# Altium schematic sheet AMS_Slave_Balancing.SchDoc: Sheetname
size A4; Date: 05.10.2017; CheckedBy: UNCHECKED; Author: Team Member; Organization: Baltic Racing; Address1: Zur Schwedenschanze 15; Address2: Haus 18; Address3: 18435 Stralsund; Revision: xx.xx; SheetNumber: 3; SheetTotal: 3; Rules: TODO; ProjectName: Projekt
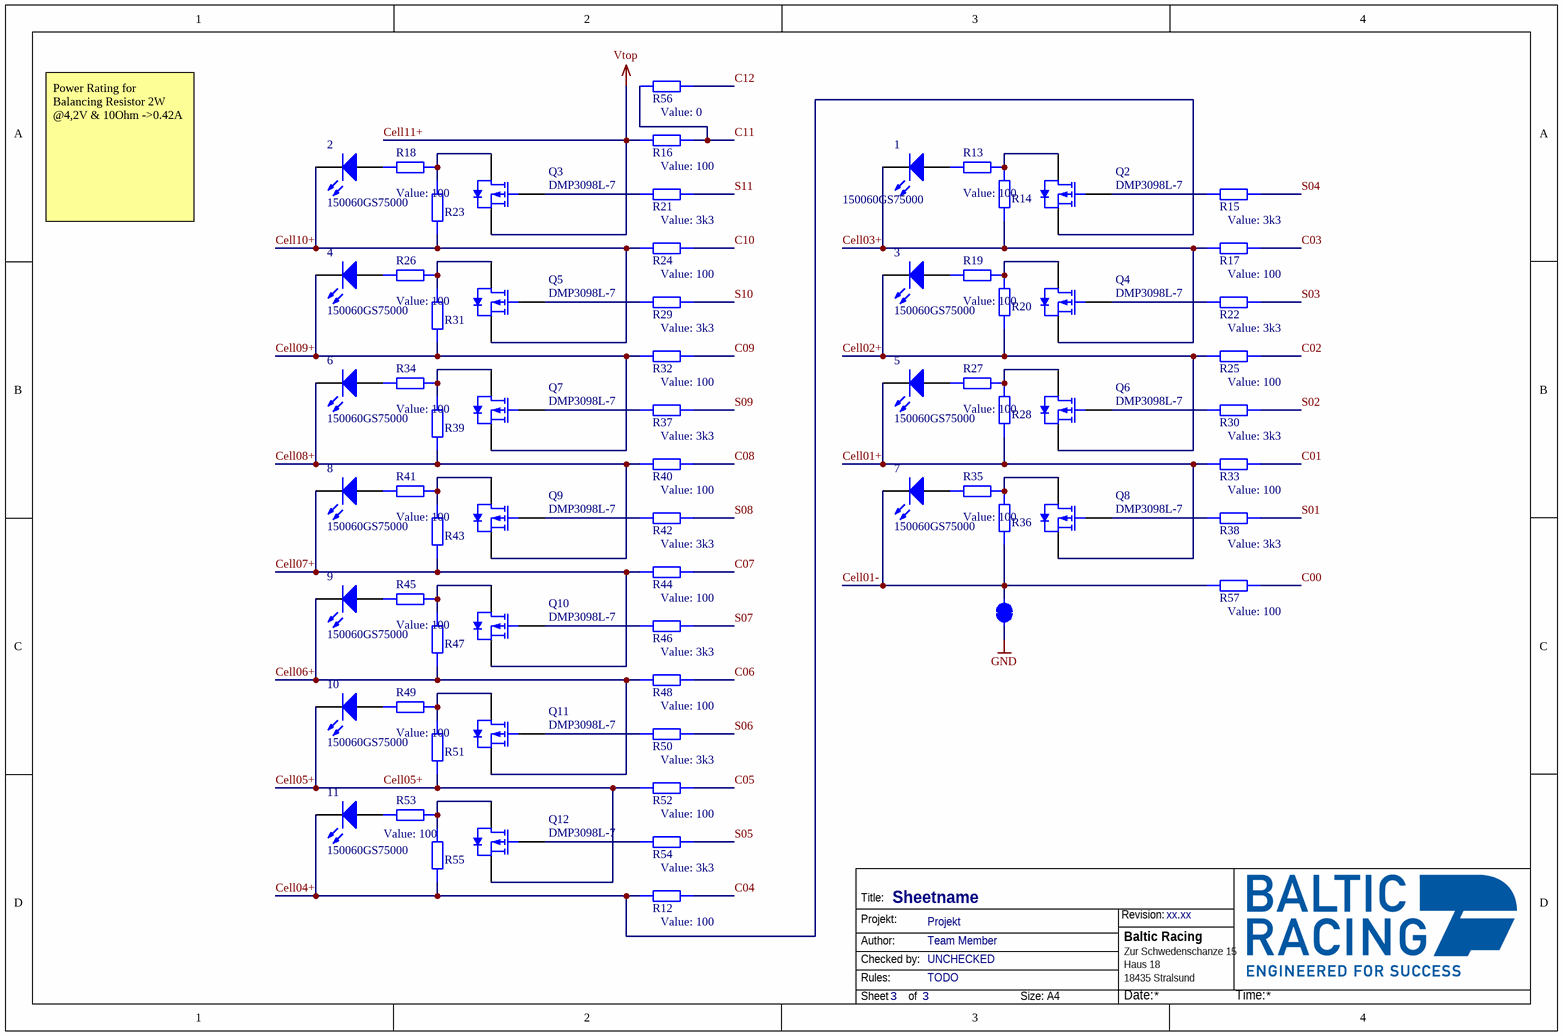
[diagram p0: AMS_Slave_Balancing.SchDoc]

## Parts
1  150060GS75000  [0603_A]
2  150060GS75000  [0603_A]
3  150060GS75000  [0603_A]
4  150060GS75000  [0603_A]
5  150060GS75000  [0603_A]
6  150060GS75000  [0603_A]
7  150060GS75000  [0603_A]
8  150060GS75000  [0603_A]
9  150060GS75000  [0603_A]
10  150060GS75000  [0603_A]
11  150060GS75000  [0603_A]
J5  SMD Jumper closed  [SMD-JUMPER-CLOSED]  (value not drawn)  (net tie, no BOM)
Q2  DMP3098L-7  [DIOD-SOT23-3_V]
Q3  DMP3098L-7  [DIOD-SOT23-3_V]
Q4  DMP3098L-7  [DIOD-SOT23-3_V]
Q5  DMP3098L-7  [DIOD-SOT23-3_V]
Q6  DMP3098L-7  [DIOD-SOT23-3_V]
Q7  DMP3098L-7  [DIOD-SOT23-3_V]
Q8  DMP3098L-7  [DIOD-SOT23-3_V]
Q9  DMP3098L-7  [DIOD-SOT23-3_V]
Q10  DMP3098L-7  [DIOD-SOT23-3_V]
Q11  DMP3098L-7  [DIOD-SOT23-3_V]
Q12  DMP3098L-7  [DIOD-SOT23-3_V]
R12  value 100  [STACKPOLE CSR0603]  (hidden comment: Value)
R13  value 100  [STACKPOLE CSR0603]  (hidden comment: SMD Resistor)
R14  SMD Resistor  [STACKPOLE CSRN2512]  (value not drawn)
R15  value 3k3  [STACKPOLE CSR0603]  (hidden comment: SMD Resistor)
R16  value 100  [STACKPOLE CSR0603]  (hidden comment: Value)
R17  value 100  [STACKPOLE CSR0603]  (hidden comment: Value)
R18  value 100  [STACKPOLE CSR0603]  (hidden comment: SMD Resistor)
R19  value 100  [STACKPOLE CSR0603]  (hidden comment: SMD Resistor)
R20  SMD Resistor  [STACKPOLE CSRN2512]  (value not drawn)
R21  value 3k3  [STACKPOLE CSR0603]  (hidden comment: SMD Resistor)
R22  value 3k3  [STACKPOLE CSR0603]  (hidden comment: SMD Resistor)
R23  SMD Resistor  [STACKPOLE CSRN2512]  (value not drawn)
R24  value 100  [STACKPOLE CSR0603]  (hidden comment: Value)
R25  value 100  [STACKPOLE CSR0603]  (hidden comment: Value)
R26  value 100  [STACKPOLE CSR0603]  (hidden comment: SMD Resistor)
R27  value 100  [STACKPOLE CSR0603]  (hidden comment: SMD Resistor)
R28  SMD Resistor  [STACKPOLE CSRN2512]  (value not drawn)
R29  value 3k3  [STACKPOLE CSR0603]  (hidden comment: SMD Resistor)
R30  value 3k3  [STACKPOLE CSR0603]  (hidden comment: SMD Resistor)
R31  SMD Resistor  [STACKPOLE CSRN2512]  (value not drawn)
R32  value 100  [STACKPOLE CSR0603]  (hidden comment: Value)
R33  value 100  [STACKPOLE CSR0603]  (hidden comment: Value)
R34  value 100  [STACKPOLE CSR0603]  (hidden comment: SMD Resistor)
R35  value 100  [STACKPOLE CSR0603]  (hidden comment: SMD Resistor)
R36  SMD Resistor  [STACKPOLE CSRN2512]  (value not drawn)
R37  value 3k3  [STACKPOLE CSR0603]  (hidden comment: SMD Resistor)
R38  value 3k3  [STACKPOLE CSR0603]  (hidden comment: SMD Resistor)
R39  SMD Resistor  [STACKPOLE CSRN2512]  (value not drawn)
R40  value 100  [STACKPOLE CSR0603]  (hidden comment: Value)
R41  value 100  [STACKPOLE CSR0603]  (hidden comment: SMD Resistor)
R42  value 3k3  [STACKPOLE CSR0603]  (hidden comment: SMD Resistor)
R43  SMD Resistor  [STACKPOLE CSRN2512]  (value not drawn)
R44  value 100  [STACKPOLE CSR0603]  (hidden comment: Value)
R45  value 100  [STACKPOLE CSR0603]  (hidden comment: SMD Resistor)
R46  value 3k3  [STACKPOLE CSR0603]  (hidden comment: SMD Resistor)
R47  SMD Resistor  [STACKPOLE CSRN2512]  (value not drawn)
R48  value 100  [STACKPOLE CSR0603]  (hidden comment: Value)
R49  value 100  [STACKPOLE CSR0603]  (hidden comment: SMD Resistor)
R50  value 3k3  [STACKPOLE CSR0603]  (hidden comment: SMD Resistor)
R51  SMD Resistor  [STACKPOLE CSRN2512]  (value not drawn)
R52  value 100  [STACKPOLE CSR0603]  (hidden comment: Value)
R53  value 100  [STACKPOLE CSR0603]  (hidden comment: SMD Resistor)
R54  value 3k3  [STACKPOLE CSR0603]  (hidden comment: SMD Resistor)
R55  SMD Resistor  [STACKPOLE CSRN2512]  (value not drawn)
R56  value 0  [STACKPOLE CSR0603]  (hidden comment: Value)
R57  value 100  [STACKPOLE CSR0603]  (hidden comment: Value)

## Nets
Cell11+: Q3.2(S) R16.1  [also labelled Vtop]
GND: J5.1
C00: R57.2
C01: R33.2
C02: R25.2
C03: R17.2
C04: R12.2
C05: R52.2
C06: R48.2
C07: R44.2
C08: R40.2
C09: R32.2
C10: R24.2
C11: R16.2 R56.1
C12: R56.2
Cell01+: 5.1(K) Q8.2(S) R28.1 R33.1
Cell01-: 7.1(K) J5.2 R36.1 R57.1
Cell02+: 3.1(K) Q6.2(S) R20.1 R25.1
Cell03+: 1.1(K) Q4.2(S) R14.1 R17.1
Cell04+: 11.1(K) Q2.2(S) R12.1 R55.1
Cell05+: 10.1(K) Q12.2(S) R51.1 R52.1
Cell06+: 9.1(K) Q11.2(S) R47.1 R48.1
Cell07+: 8.1(K) Q10.2(S) R43.1 R44.1
Cell08+: 6.1(K) Q9.2(S) R39.1 R40.1
Cell09+: 4.1(K) Q7.2(S) R31.1 R32.1
Cell10+: 2.1(K) Q5.2(S) R23.1 R24.1
S01: R38.2
S02: R30.2
S03: R22.2
S04: R15.2
S05: R54.2
S06: R50.2
S07: R46.2
S08: R42.2
S09: R37.2
S10: R29.2
S11: R21.2
Net1_2: 1.2(A) R13.2
Net2_2: 2.2(A) R18.2
Net3_2: 3.2(A) R19.2
Net4_2: 4.2(A) R26.2
Net5_2: 5.2(A) R27.2
Net6_2: 6.2(A) R34.2
Net7_2: 7.2(A) R35.2
Net8_2: 8.2(A) R41.2
Net9_2: 9.2(A) R45.2
Net10_2: 10.2(A) R49.2
Net11_2: 11.2(A) R53.2
NetQ2_1: Q2.1(G) R15.1
NetQ2_3: Q2.3(D) R13.1 R14.2
NetQ3_1: Q3.1(G) R21.1
NetQ3_3: Q3.3(D) R18.1 R23.2
NetQ4_1: Q4.1(G) R22.1
NetQ4_3: Q4.3(D) R19.1 R20.2
NetQ5_1: Q5.1(G) R29.1
NetQ5_3: Q5.3(D) R26.1 R31.2
NetQ6_1: Q6.1(G) R30.1
NetQ6_3: Q6.3(D) R27.1 R28.2
NetQ7_1: Q7.1(G) R37.1
NetQ7_3: Q7.3(D) R34.1 R39.2
NetQ8_1: Q8.1(G) R38.1
NetQ8_3: Q8.3(D) R35.1 R36.2
NetQ9_1: Q9.1(G) R42.1
NetQ9_3: Q9.3(D) R41.1 R43.2
NetQ10_1: Q10.1(G) R46.1
NetQ10_3: Q10.3(D) R45.1 R47.2
NetQ11_1: Q11.1(G) R50.1
NetQ11_3: Q11.3(D) R49.1 R51.2
NetQ12_1: Q12.1(G) R54.1
NetQ12_3: Q12.3(D) R53.1 R55.2

## Notes on the sheet
- Power Rating for Balancing Resistor 2W @4,2V & 10Ohm ->0.42A
- Title:
- Projekt:
- Revision:
- Author:
- Rules:
- Checked by:
- Sheet
- of
- Size:
- A4
- Date:
- Time:

## Library data of the parts
1-11 = CMP-1426-00002-1: SMD mono-color Chip LED, WL-SMCW, Green; Manufacturer: Wuerth Elektronik; ComponentLink1URL: http://www.we-online.com; ComponentLink2Description: Datasheet; Color: Green; ComponentLink2URL: http://katalog.we-online.com/led/datasheet/150060GS75000.pdf; PartNumber: 150060GS75000; PackageReference: 0603_A; ComponentLink1Description: Manufacturer URL
Q2-Q12 = CMP-0697-00001-2: P-Channel Enhancement Mode MOSFET, -30 V VDS, -55 to 155 degC, 3-Pin SOT23, RoHS, Tape and Reel; Manufacturer: Diodes Inc; PD (TA: 25 degC)=1.08 W; VGS: +/- 20 V; VDS: -30 V; IDS (TA: 25 degC)=-3.8 A; RDS(on) (Max.) (VGS: 4.5 V)=120 mOhm; VGS(th) (Max.): -2.1 V; ComponentLink3Description: Package Specification; ComponentLink3URL: http://www.diodes.com/datasheets/ap02002.pdf; PackageDescription: 3-Pin Small Outline Transistor, Body 1.3 x 2.9 mm, Pitch 0.95 mm; PackageReference: SOT23; PartNumber: DMP3098L-7; ComponentLink1Description: Manufacturer URL; ComponentLink2Description: Datasheet; ComponentLink2URL: http://www.diodes.com/datasheets/ds31447.pdf; ComponentLink1URL: http://www.diodes.com/; DatasheetVersion: Rev. 8 - 2; Mounting Technology: Surface Mount; RoHS: TRUE; Packing: Tape and Reel; PackageVersion: Rev. 75; Operating Temperature Range: -55 to 150 degC
R12 R13 R15-R19 R21 R22 R24-R27 R29 R30 R32-R35 R37 R38 R40-R42 R44-R46 R48-R50 R52-R54 R56 R57 = SMD Resistor: Resistor with multiple footprints
R14 R20 R23 R28 R31 R36 R39 R43 R47 R51 R55 = SMD Resistor: Resistor with multiple footprints; Value: 10